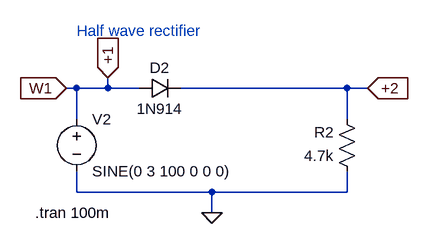
[diagram p0: schematic half_wave_rect.asc]
half_wave_rect.asc, the LTspice schematic file:
Version 4
SHEET 1 880 680
WIRE 32 -208 16 -208
WIRE 80 -208 80 -224
WIRE 80 -208 32 -208
WIRE 128 -208 80 -208
WIRE 448 -208 192 -208
WIRE 480 -208 448 -208
WIRE 32 -160 32 -208
WIRE 448 -160 448 -208
WIRE 32 -48 32 -80
WIRE 240 -48 32 -48
WIRE 448 -48 448 -80
WIRE 448 -48 240 -48
WIRE 240 -16 240 -48
FLAG 240 -16 0
FLAG 16 -208 W1
IOPIN 16 -208 In
FLAG 80 -224 +1
IOPIN 80 -224 In
FLAG 480 -208 +2
IOPIN 480 -208 In
SYMBOL diode 128 -192 R270
WINDOW 0 32 32 VTop 2
WINDOW 3 0 32 VBottom 2
SYMATTR InstName D2
SYMATTR Value 1N914
SYMBOL res 464 -64 R180
WINDOW 0 36 76 Left 2
WINDOW 3 36 40 Left 2
SYMATTR InstName R2
SYMATTR Value 4.7k
SYMBOL voltage 32 -176 R0
WINDOW 123 0 0 Left 0
WINDOW 39 0 0 Left 0
SYMATTR InstName V2
SYMATTR Value SINE(0 3 100 0 0 0)
TEXT -32 -16 Left 2 !.tran 100m
TEXT 32 -296 Left 2 ;Half wave rectifier

The netlist it stands for:
* half_wave_rect.asc
D2 +1 +2 1N914
R2 0 +2 4.7k
V2 +1 0 SINE(0 3 100 0 0 0)
.model D D
.lib standard.dio
.tran 100m
* Half wave rectifier
.backanno
.end